# EAGLE design driver_module (EAGLE 7.3.0)
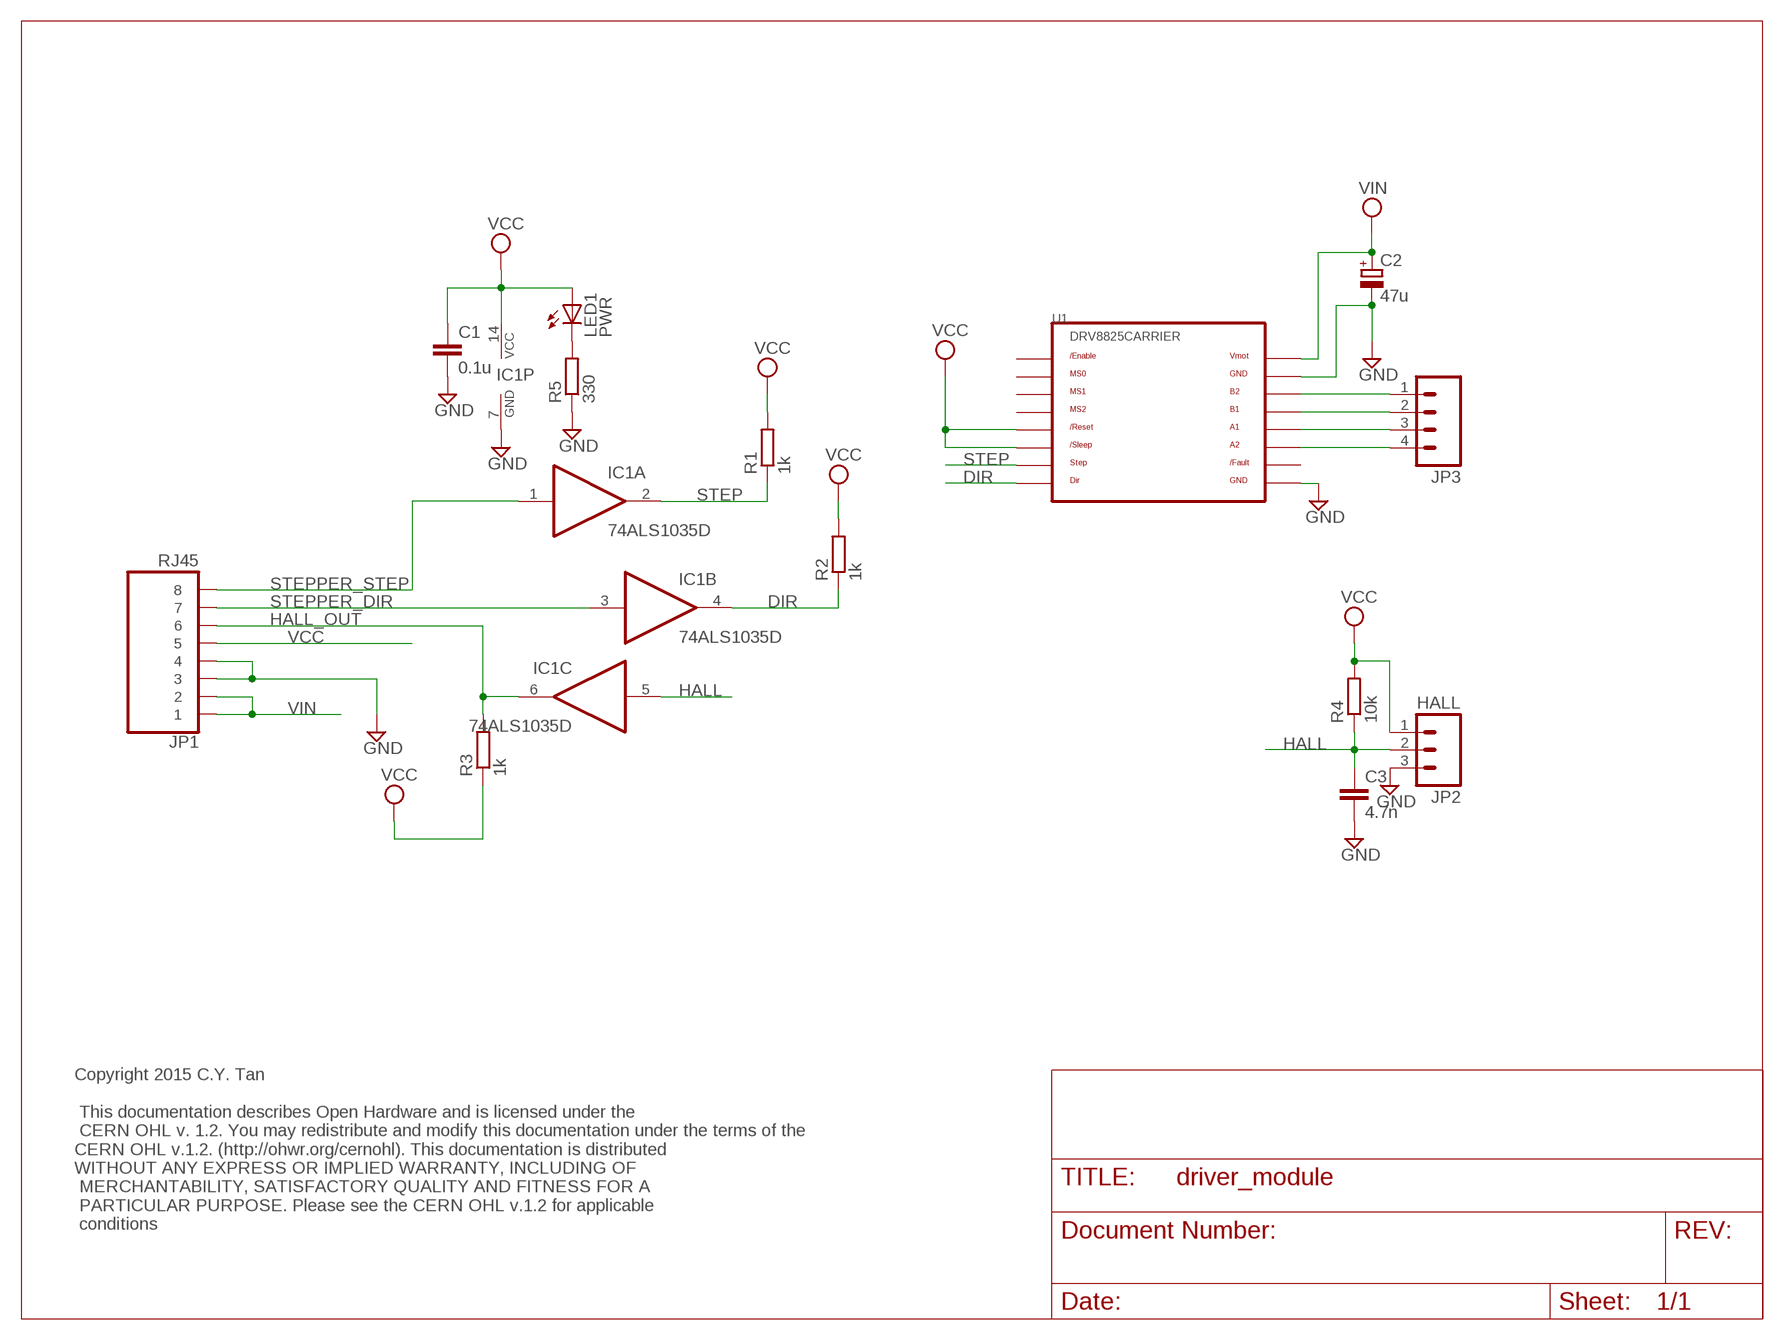
[diagram p0: schematic, sheet 1]

## Parts
C1  0.1u  C-EUC1206  [C1206]
C2  47u  CPOL-EUE2.5-6  [E2,5-6]
C3  4.7n  C-EUC1206  [C1206]
IC1  74ALS1035D  [SO14]
JP1  RJ45  RJ45-8PTH  [RJ45-8]
JP2  HALL  M03PTH  [1X03]
JP3  M04PTH  [1X04]
LED1  PWR  LEDCHIPLED_1206  [CHIPLED_1206]
R1  1k  R-EU_M0805  [M0805]
R2  1k  R-EU_M0805  [M0805]
R3  1k  R-EU_M0805  [M0805]
R4  10k  R-EU_M0805  [M0805]
R5  330  R-EU_M0805  [M0805]
U1  DRV8825CARRIER  [DRV8825CARRIER]

## Nets
DIR: IC1.4(B:O) R2.1 U1.DIR
GND: C1.2 C2.- C3.2 IC1.7(P:GND) JP1.3 JP1.4 JP2.3 R5.1 U1.GND@0(GND) U1.GND@1(GND)
HALL: C3.1 IC1.5(C:I) JP2.2 R4.1
HALL_OUT: IC1.6(C:O) JP1.6 R3.2
N$1: JP3.1 U1.B2
N$2: JP3.2 U1.B1
N$3: LED1.C R5.2
N$4: JP3.3 U1.A1
N$5: JP3.4 U1.A2
STEP: IC1.2(A:O) R1.1 U1.STEP
STEPPER_DIR: IC1.3(B:I) JP1.7
STEPPER_STEP: IC1.1(A:I) JP1.8
VCC: C1.1 IC1.14(P:VCC) JP1.5 JP2.1 LED1.A R1.2 R2.2 R3.1 R4.2 U1./RESET U1./SLEEP
VIN: C2.+ JP1.1 JP1.2 U1.VMOT
Unconnected: IC1.8(D:O) IC1.9(D:I) IC1.10(E:O) IC1.11(E:I) IC1.12(F:O) IC1.13(F:I) U1./ENABLE U1.M0(MS0) U1.M1(MS1) U1.M2(MS2)

## Notes on the sheet
- Copyright 2015 C.Y. Tan
  
   This documentation describes Open Hardware and is licensed under the
   CERN OHL v. 1.2. You may redistribute and modify this documentation under the terms of the 
  CERN OHL v.1.2. (http://ohwr.org/cernohl). This documentation is distributed 
  WITHOUT ANY EXPRESS OR IMPLIED WARRANTY, INCLUDING OF
   MERCHANTABILITY, SATISFACTORY QUALITY AND FITNESS FOR A
   PARTICULAR PURPOSE. Please see the CERN OHL v.1.2 for applicable
   conditions

## Power pins joined to a net without a drawn wire
/FAULT: U1./FAULT

## Library data of the parts
C1 C3 = resistor:C-EU: CAPACITOR, European symbol
C2 = resistor:CPOL-EU: POLARIZED CAPACITOR, European symbol
IC1 = cytan:74ALS1035: Hex noninverting buffers with open-collector outputs
JP1 = cytan:RJ45-8: RJ45 Jack RJ45, 8-pin connection. SKU: Jameco 524461.; PROD_ID: Jameco-524461
JP2 = cytan:M03: Header 3 Standard 3-pin 0.1" header. Use with straight break away headers (SKU : PRT-00116), right angle break away headers (PRT-00553), swiss pins (PRT-00743), machine pins (PRT-00117), and female headers (PRT-00115). Molex polarized connector foot print use with SKU : PRT-08232 with associated crimp pins and housings.
JP3 = SparkFun-Connectors:M04: Header 4 Standard 4-pin 0.1" header. Use with straight break away headers (SKU : PRT-00116), right angle break away headers (PRT-00553), swiss pins (PRT-00743), machine pins (PRT-00117), and female headers (PRT-00115). Molex polarized connector foot print use with SKU : PRT-08231 with associated crimp pins and housings. 1MM SMD Version SKU: PRT-10208
LED1 = led:LED: LED OSRAM: - CHIPLED LG R971, LG N971, LY N971, LG Q971, LY Q971, LO R971, LY R971 LH N974, LH R974 LS Q976, LO Q976, LY Q976 LO Q996 - Hyper CHIPLED LW Q18S LB Q993, LB Q99A, LB R99A - SideLED LS A670, LO A670, LY A670, LG A670, LP A670 LB A673, LV A673, LT A673, LW A673 LH A674 LY A675 LS A676, LA A676, LO A676, LY A676, LW A676 LS A679, LY A679, LG A679 - Hyper Micro SIDELED® LS Y876, LA Y876, LO Y876, LY Y876 LT Y87S - SmartLED LW L88C, LW L88S LB L89C, LB L89S, LG L890 LS L89K, LO L89K, LY L89K LS L896, LA L896, LO L896, LY L896 - TOPLED LS T670, LO T670, LY T670, LG T670, LP T670 LSG T670, LSP T670, LSY T670, LOP T670, LYG T670 LG T671, LOG T671, LSG T671 LB T673, LV T673, LT T673, LW T673 LH T674 LS T676, LA T676, LO T676, LY T676, LB T676, LH T676, LSB T676, LW T676 LB T67C, LV T67C, LT T67C, LS T67K, LO T67K, LY T67K, LW E67C LS E67B, LA E67B, LO E67B, LY E67B, LB E67C, LV E67C, LT E67C LW T67C LS T679, LY T679, LG T679 LS T770, LO T770, LY T770, LG T770, LP T770 LB T773, LV T773, LT T773, LW T773 LH T774 LS E675, LA E675, LY E675, LS T675 LS T776, LA T776, LO T776, LY T776, LB T776 LHGB T686 LT T68C, LB T68C - Hyper Mini TOPLED® LB M676 - Mini TOPLED Santana® LG M470 LS M47K, LO M47K, LY M47K Source: http://www.osram.convergy.de LUXEON: - LUMILED® LXK2-PW12-R00, LXK2-PW12-S00, LXK2-PW14-U00, LXK2-PW14-V00 LXK2-PM12-R00, LXK2-PM12-S00, LXK2-PM14-U00 LXK2-PE12-Q00, LXK2-PE12-R00, LXK2-PE12-S00, LXK2-PE14-T00, LXK2-PE14-U00 LXK2-PB12-K00, LXK2-PB12-L00, LXK2-PB12-M00, LXK2-PB14-N00, LXK2-PB14-P00, LXK2-PB14-Q00 LXK2-PR12-L00, LXK2-PR12-M00, LXK2-PR14-Q00, LXK2-PR14-R00 LXK2-PD12-Q00, LXK2-PD12-R00, LXK2-PD12-S00 LXK2-PH12-R00, LXK2-PH12-S00 LXK2-PL12-P00, LXK2-PL12-Q00, LXK2-PL12-R00 Source: www.luxeon.com KINGBRIGHT: KA-3528ASYC Source: www.kingbright.com
R1-R5 = resistor:R-EU_: RESISTOR, European symbol
U1 = cytan:DRV8825CARRIER: Pololu DRV8825 Stepper Motor Driver Carrier, High Current

## Board
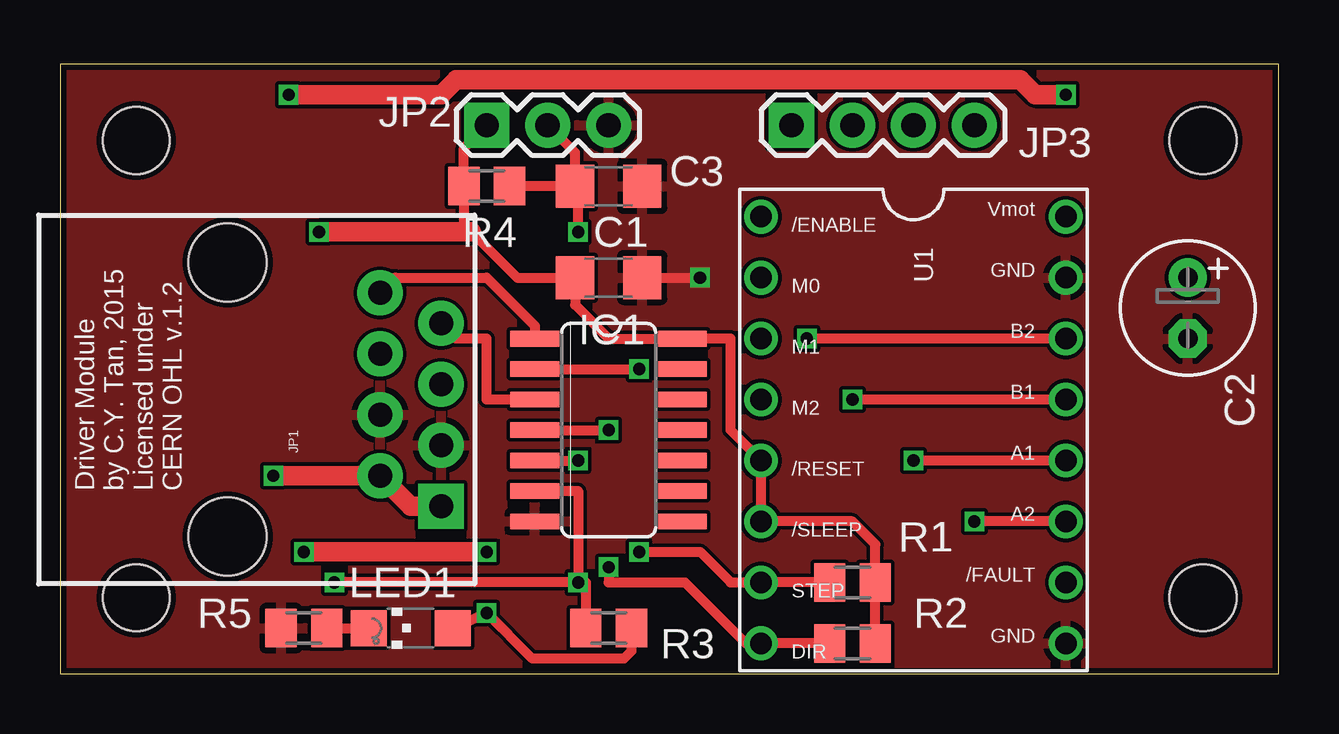
[diagram p1: board, top side]
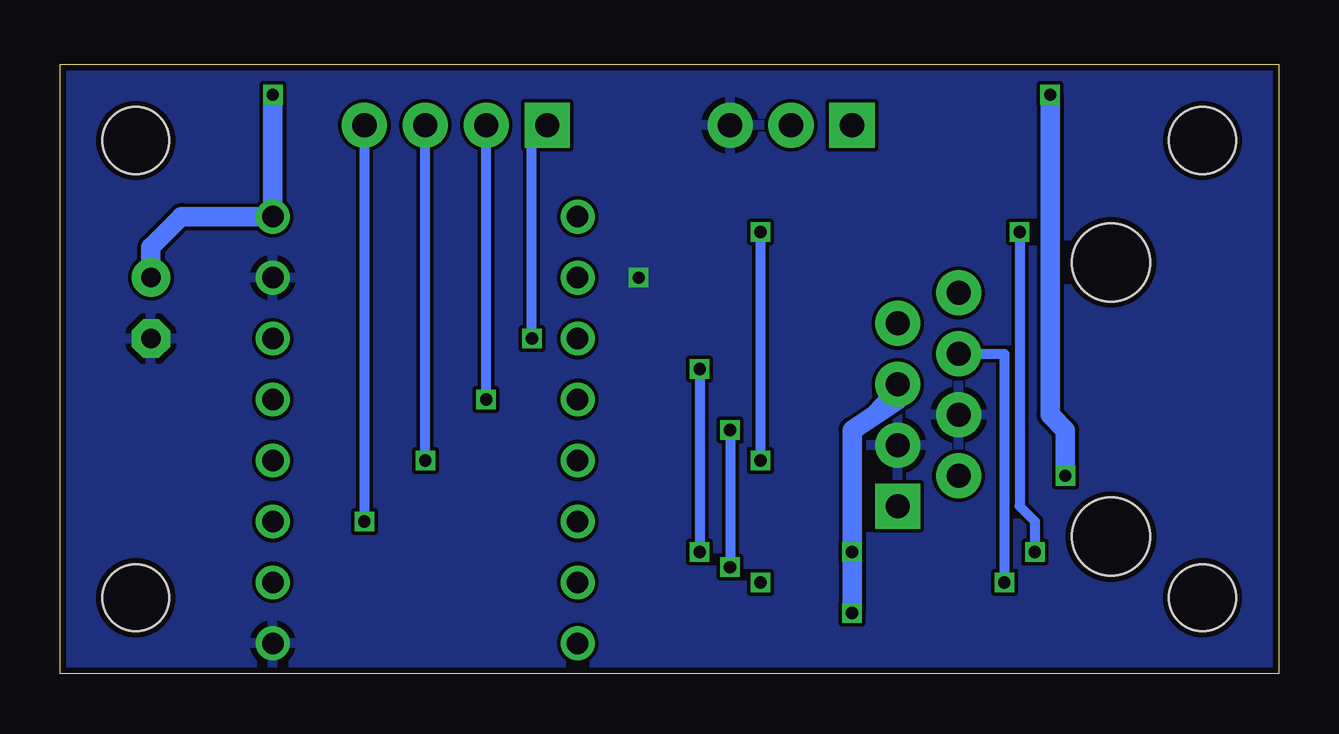
[diagram p2: board, bottom side, seen from below]

Size 50.78 x 25.4 mm. Coordinates in mm from the lower left corner, seen from the top.
Outline: 0,0 50.78,0 50.78,25.4 0,25.4 0,0
Copper layers (1*16): Top 0.035mm / dielectric 1.5mm / Bottom 0.035mm
Design rules "ITEADstudio_DRC": minimum track width 6mil, minimum drill 12mil, track to track 6mil, track to pad 6mil, pad to pad 6mil, via to via 6mil, smd to smd 0mil, copper to edge 10mil, drill to drill 10mil, minimum pad ring 10mil, minimum via ring 6mil, stop-mask expansion 2mil, vias tented up to drill 100mil, thermal gap 10mil
Holes 2.78 mm at 3.17,3.17 3.17,22.23 47.62,22.23 47.62,3.17

### Footprints (pad centres in the part's own frame; a part is rotated, then mirrored left to right if it is on the bottom)
C1206 = smd 1.6 x 1.8: 1 -1.4,0; 2 1.4,0
E2,5-6 = drill 0.813 pad 1.6: + -1.27,0 | drill 0.813 pad 1.6 octagon: - 1.27,0
SO14 = smd 0.66 x 2.032: 1 -3.81,-3.073; 2 -2.54,-3.073; 3 -1.27,-3.073; 4 0,-3.073; 5 1.27,-3.073; 6 2.54,-3.073; 7 3.81,-3.073; 8 3.81,3.073; 9 2.54,3.073; 10 1.27,3.073; 11 0,3.073; 12 -1.27,3.073; 13 -2.54,3.073; 14 -3.81,3.073
RJ45-8 = drill 1 pad 1.88 square: 1 4.445,8.89 | drill 1 pad 1.88: 2 3.175,6.35; 3 1.905,8.89; 4 0.635,6.35; 5 -0.635,8.89; 6 -1.905,6.35; 7 -3.175,8.89; 8 -4.445,6.35 | hole 3.251: -5.715,0; 5.715,0
1X03 = drill 1.016 pad 1.88 square: 1 0,0 | drill 1.016 pad 1.88: 2 2.54,0; 3 5.08,0
1X04 = drill 1.016 pad 1.88 square: 1 0,0 | drill 1.016 pad 1.88: 2 2.54,0; 3 5.08,0; 4 7.62,0
CHIPLED_1206 = smd 1.5 x 1.5: A 0,-1.75; C 0,1.75
M0805 = smd 1.3 x 1.6: 1 -0.95,0; 2 0.95,0
DRV8825CARRIER = drill 0.9: /ENABLE -1.27,-11.43; /FAULT 13.97,1.27; /RESET 8.89,-11.43; /SLEEP 11.43,-11.43; A1 8.89,1.27; A2 11.43,1.27; B1 6.35,1.27; B2 3.81,1.27; DIR 16.51,-11.43; GND@0 1.27,1.27; GND@1 16.51,1.27; M0 1.27,-11.43; M1 3.81,-11.43; M2 6.35,-11.43; STEP 13.97,-11.43; VMOT -1.27,1.27

### Placement (x,y rotation side)
C1  22.86,16.51 0 top
C2  46.99,15.24 270 top
C3  22.86,20.32 0 top
IC1  22.86,10.16 270 top
JP1  6.99,11.43 270 top
JP2  17.78,22.86 0 top
JP3  30.48,22.86 0 top
LED1  14.61,1.91 90 top
R1  33.02,3.81 0 top
R2  33.02,1.27 0 top
R3  22.86,1.91 180 top
R4  17.78,20.32 180 top
R5  10.16,1.91 0 top
U1  40.64,17.78 270 top

### Tracks (layer width: path | path; a pad name or v marks a point on that pad's centre or on a via)
DIR  (via drill 0.51)
  Top 0.406: IC1.4 v22.86,10.16 | v22.86,4.45 22.86,3.81 26.04,3.81 28.57,1.27 U1.DIR R2.1
  Bottom 0.406: v22.86,10.16 v22.86,4.45
GND  (via drill 0.51)
  Top 0.406: C1.2 v26.67,16.51
  pour Top: 0,25.4 0,0 50.8,0 50.8,25.4
  pour Bottom: 0,25.4 50.8,25.4 50.8,0 0,0
HALL  (via drill 0.51)
  Top 0.406: IC1.5 v21.59,8.89 | v21.59,18.41 21.59,20.19 C3.1 | C3.1 R4.1 | C3.1 21.46,21.72 JP2.2
  Bottom 0.406: v21.59,8.89 v21.59,18.41
HALL_OUT  (via drill 0.51)
  Top 0.406: IC1.6 21.59,7.62 v21.59,3.81 | v21.59,3.81 v11.43,3.81 | v21.59,3.81 21.91,3.81 R3.2
  Bottom 0.406: JP1.6 11.43,13.34 v11.43,3.81
N$1  (via drill 0.51)
  Top 0.406: U1.B2 v31.11,13.97
  Bottom 0.406: v31.11,13.97 31.11,22.23 JP3.1
N$2  (via drill 0.51)
  Top 0.406: U1.B1 v33.02,11.43
  Bottom 0.406: v33.02,11.43 JP3.2
N$3
  Top 0.406: R5.2 LED1.C
N$4  (via drill 0.51)
  Top 0.406: U1.A1 v35.56,8.89
  Bottom 0.406: v35.56,8.89 JP3.3
N$5  (via drill 0.51)
  Top 0.406: U1.A2 v38.1,6.35
  Bottom 0.406: JP3.4 v38.1,6.35
STEP  (via drill 0.51)
  Top 0.406: IC1.2 v24.13,12.7 | v24.13,5.08 26.67,5.08 27.94,3.81 U1.STEP R1.1
  Bottom 0.406: v24.13,12.7 v24.13,5.08
STEPPER_DIR
  Top 0.406: IC1.3 17.78,11.43 17.78,13.97 16.51,13.97 JP1.7
STEPPER_STEP
  Top 0.406: JP1.8 13.97,16.51 17.78,16.51 19.79,14.5 IC1.1
VCC  (via drill 0.51)
  Top 0.406: LED1.A v17.78,2.54 | v17.78,2.54 18.41,1.91 | JP2.1 16.83,21.91 R4.2 16.83,18.73 17.14,18.41 19.05,16.51 C1.1 21.46,15.37 22.86,13.97 IC1.14 27.94,13.97 27.94,10.16 U1./RESET U1./SLEEP 33.02,6.35 33.97,5.4 R1.2 R2.2 | R3.1 23.81,0.95 23.5,0.64 19.68,0.64 v17.78,2.54
  Top 0.813: 17.14,18.41 v10.79,18.41 | v10.16,5.08 v17.78,5.08
  Bottom 0.406: JP1.5 17.78,10.16 | v10.79,18.41 10.79,6.99 10.16,6.35 v10.16,5.08
  Bottom 0.813: JP1.5 15.88,11.43 17.78,10.16 v17.78,5.08 v17.78,2.54
VIN  (via drill 0.51)
  Top 0.813: JP1.1 14.61,6.99 JP1.2 v8.89,8.26 | v9.53,24.13 15.88,24.13 16.51,24.77 40.01,24.77 40.64,24.13 v41.91,24.13
  Bottom 0.813: v41.91,24.13 U1.VMOT 45.72,19.05 46.99,17.78 C2.+ | v9.53,24.13 9.53,10.79 8.89,10.16 v8.89,8.26

### Text on the board
tPlace: Driver Module / by C.Y. Tan, 2015 / Licensed under / CERN OHL v.1.2